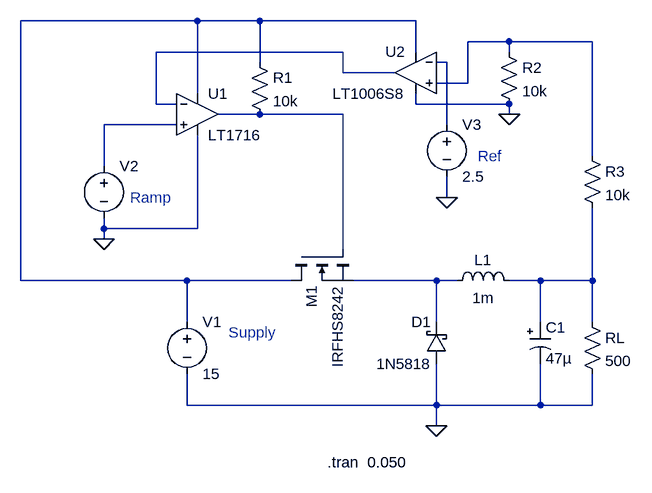
[diagram p0: schematic simple-buck1.asc]
simple-buck1.asc, the LTspice schematic file:
Version 4
SHEET 1 880 680
WIRE -128 -336 -400 -336
WIRE -32 -336 -128 -336
WIRE 208 -336 -32 -336
WIRE 352 -304 288 -304
WIRE 480 -304 352 -304
WIRE 96 -288 -192 -288
WIRE 208 -288 208 -336
WIRE 352 -288 352 -304
WIRE -32 -272 -32 -336
WIRE 256 -272 240 -272
WIRE 96 -256 96 -288
WIRE 176 -256 96 -256
WIRE 288 -240 288 -304
WIRE 288 -240 240 -240
WIRE -128 -224 -128 -336
WIRE -192 -208 -192 -288
WIRE -160 -208 -192 -208
WIRE 208 -208 208 -224
WIRE 352 -208 208 -208
WIRE -32 -192 -96 -192
WIRE 96 -192 -32 -192
WIRE 352 -192 352 -208
WIRE -160 -176 -272 -176
WIRE 256 -176 256 -272
WIRE 480 -128 480 -304
WIRE -272 -112 -272 -176
WIRE 256 -64 256 -96
WIRE -272 -16 -272 -32
WIRE -128 -16 -128 -160
WIRE -128 -16 -272 -16
WIRE -272 0 -272 -16
WIRE 96 16 96 -192
WIRE -400 64 -400 -336
WIRE -144 64 -400 64
WIRE 16 64 -144 64
WIRE 240 64 112 64
WIRE 272 64 240 64
WIRE 400 64 352 64
WIRE 480 64 480 -48
WIRE 480 64 400 64
WIRE -144 128 -144 64
WIRE 240 128 240 64
WIRE 400 128 400 64
WIRE 480 128 480 64
WIRE -144 256 -144 208
WIRE 240 256 240 192
WIRE 240 256 -144 256
WIRE 400 256 400 192
WIRE 400 256 240 256
WIRE 480 256 480 208
WIRE 480 256 400 256
WIRE 240 288 240 256
FLAG 240 288 0
FLAG -272 0 0
FLAG 352 -192 0
FLAG 256 -64 0
SYMBOL ind 256 80 R270
WINDOW 0 32 56 VTop 2
WINDOW 3 5 56 VBottom 2
SYMATTR InstName L1
SYMATTR Value 1m
SYMATTR SpiceLine Ipk=0.069 Rser=150 Rpar=0 Cpar=0 mfg="Coiltronics" pn="DR125-124-R"
SYMBOL schottky 256 192 R180
WINDOW 0 24 64 Left 2
WINDOW 3 24 0 Left 2
SYMATTR InstName D1
SYMATTR Value 1N5818
SYMATTR Description Diode
SYMATTR Type diode
SYMBOL polcap 384 128 R0
WINDOW 3 24 56 Left 2
SYMATTR Value 47µ
SYMATTR InstName C1
SYMATTR Description Capacitor
SYMATTR Type cap
SYMATTR SpiceLine V=2.5 Irms=1.11555 Rser=0.09 Lser=0
SYMBOL res 464 112 R0
SYMATTR InstName RL
SYMATTR Value 500
SYMBOL voltage -144 112 R0
WINDOW 123 0 0 Left 2
WINDOW 39 0 0 Left 2
SYMATTR InstName V1
SYMATTR Value 15
SYMBOL nmos 16 16 M90
SYMATTR InstName M1
SYMATTR Value IRFHS8242
SYMBOL voltage -272 -128 R0
WINDOW 3 24 96 Invisible 2
SYMATTR Value PULSE(15 0 0 .0000005 .0000005 0 .000001)
SYMATTR InstName V2
SYMBOL res 336 -304 R0
SYMATTR InstName R2
SYMATTR Value 10k
SYMBOL res 464 -144 R0
SYMATTR InstName R3
SYMATTR Value 10k
SYMBOL res -48 -288 R0
SYMATTR InstName R1
SYMATTR Value 10k
SYMBOL Comparators\\LT1716 -128 -192 R0
SYMATTR InstName U1
SYMBOL voltage 256 -192 R0
WINDOW 123 0 0 Left 2
WINDOW 39 0 0 Left 2
SYMATTR InstName V3
SYMATTR Value 2.5
SYMBOL Opamps\\LT1006S8 208 -320 M0
SYMATTR InstName U2
TEXT 72 344 Left 2 !.tran  0.050
TEXT -232 -64 Left 2 ;Ramp
TEXT 304 -128 Left 2 ;Ref
TEXT -80 144 Left 2 ;Supply

The netlist it stands for:
* simple-buck1.asc
L1 N007 N008 1m Ipk=0.069 Rser=150 Rpar=0 Cpar=0 mfg="Coiltronics" pn="DR125-124-R"
D1 0 N007 1N5818
C1 N008 0 47µ V=2.5 Irms=1.11555 Rser=0.09 Lser=0
RL N008 0 500
V1 N001 0 15
M1 N001 N005 N007 N007 IRFHS8242
V2 N006 0 PULSE(15 0 0 .0000005 .0000005 0 .000001)
R2 N002 0 10k
R3 N002 N008 10k
R1 N001 N005 10k
XU1 N006 N003 N001 0 N005 LT1716  ; pins In+ In- V+ V- OUT
V3 N004 0 2.5
XU2 N002 N004 N001 0 N003 LT1006S8  ; pins In+ In- V+ V- OUT
.model D D
.lib standard.dio
.model NMOS NMOS
.model PMOS PMOS
.lib standard.mos
.tran  0.050
* Ramp
* Ref
* Supply
.lib LTC1.lib
.backanno
.end